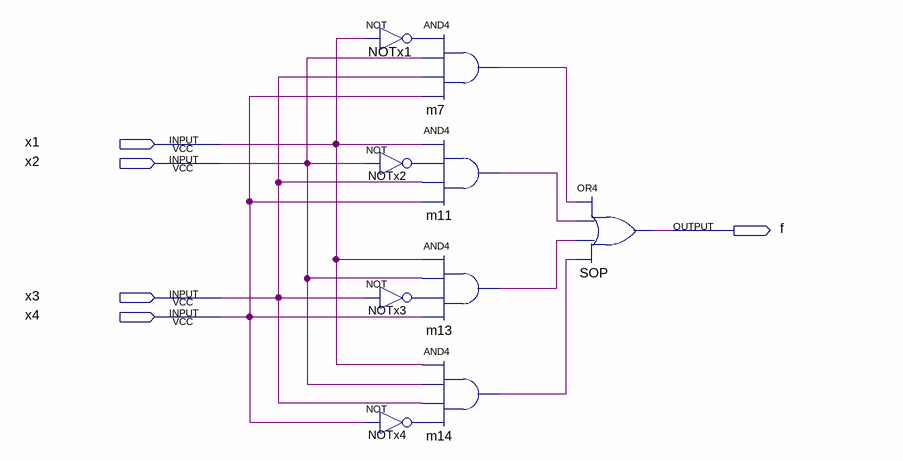
[diagram p0: schematic sheet]
// Quartus schematic Problem2.bdf as structural Verilog: 9 symbols, 5 pins
module Problem2 (
  input  x1,
  input  x2,
  input  x3,
  input  x4,
  output f
);

  wire m7_out, m11_out, m13_out, m14_out, NOTx1_out, NOTx2_out, NOTx3_out, NOTx4_out;

  and m7 (m7_out, NOTx1_out, x2, x3, x4);
  not NOTx1 (NOTx1_out, x1);
  and m11 (m11_out, x1, NOTx2_out, x3, x4);
  not NOTx2 (NOTx2_out, x2);
  and m13 (m13_out, x1, x2, NOTx3_out, x4);
  not NOTx3 (NOTx3_out, x3);
  and m14 (m14_out, x1, x2, x3, NOTx4_out);
  not NOTx4 (NOTx4_out, x4);
  or SOP (f, m7_out, m11_out, m13_out, m14_out);
endmodule
